# EAGLE design G221B (EAGLE 6.6.0)
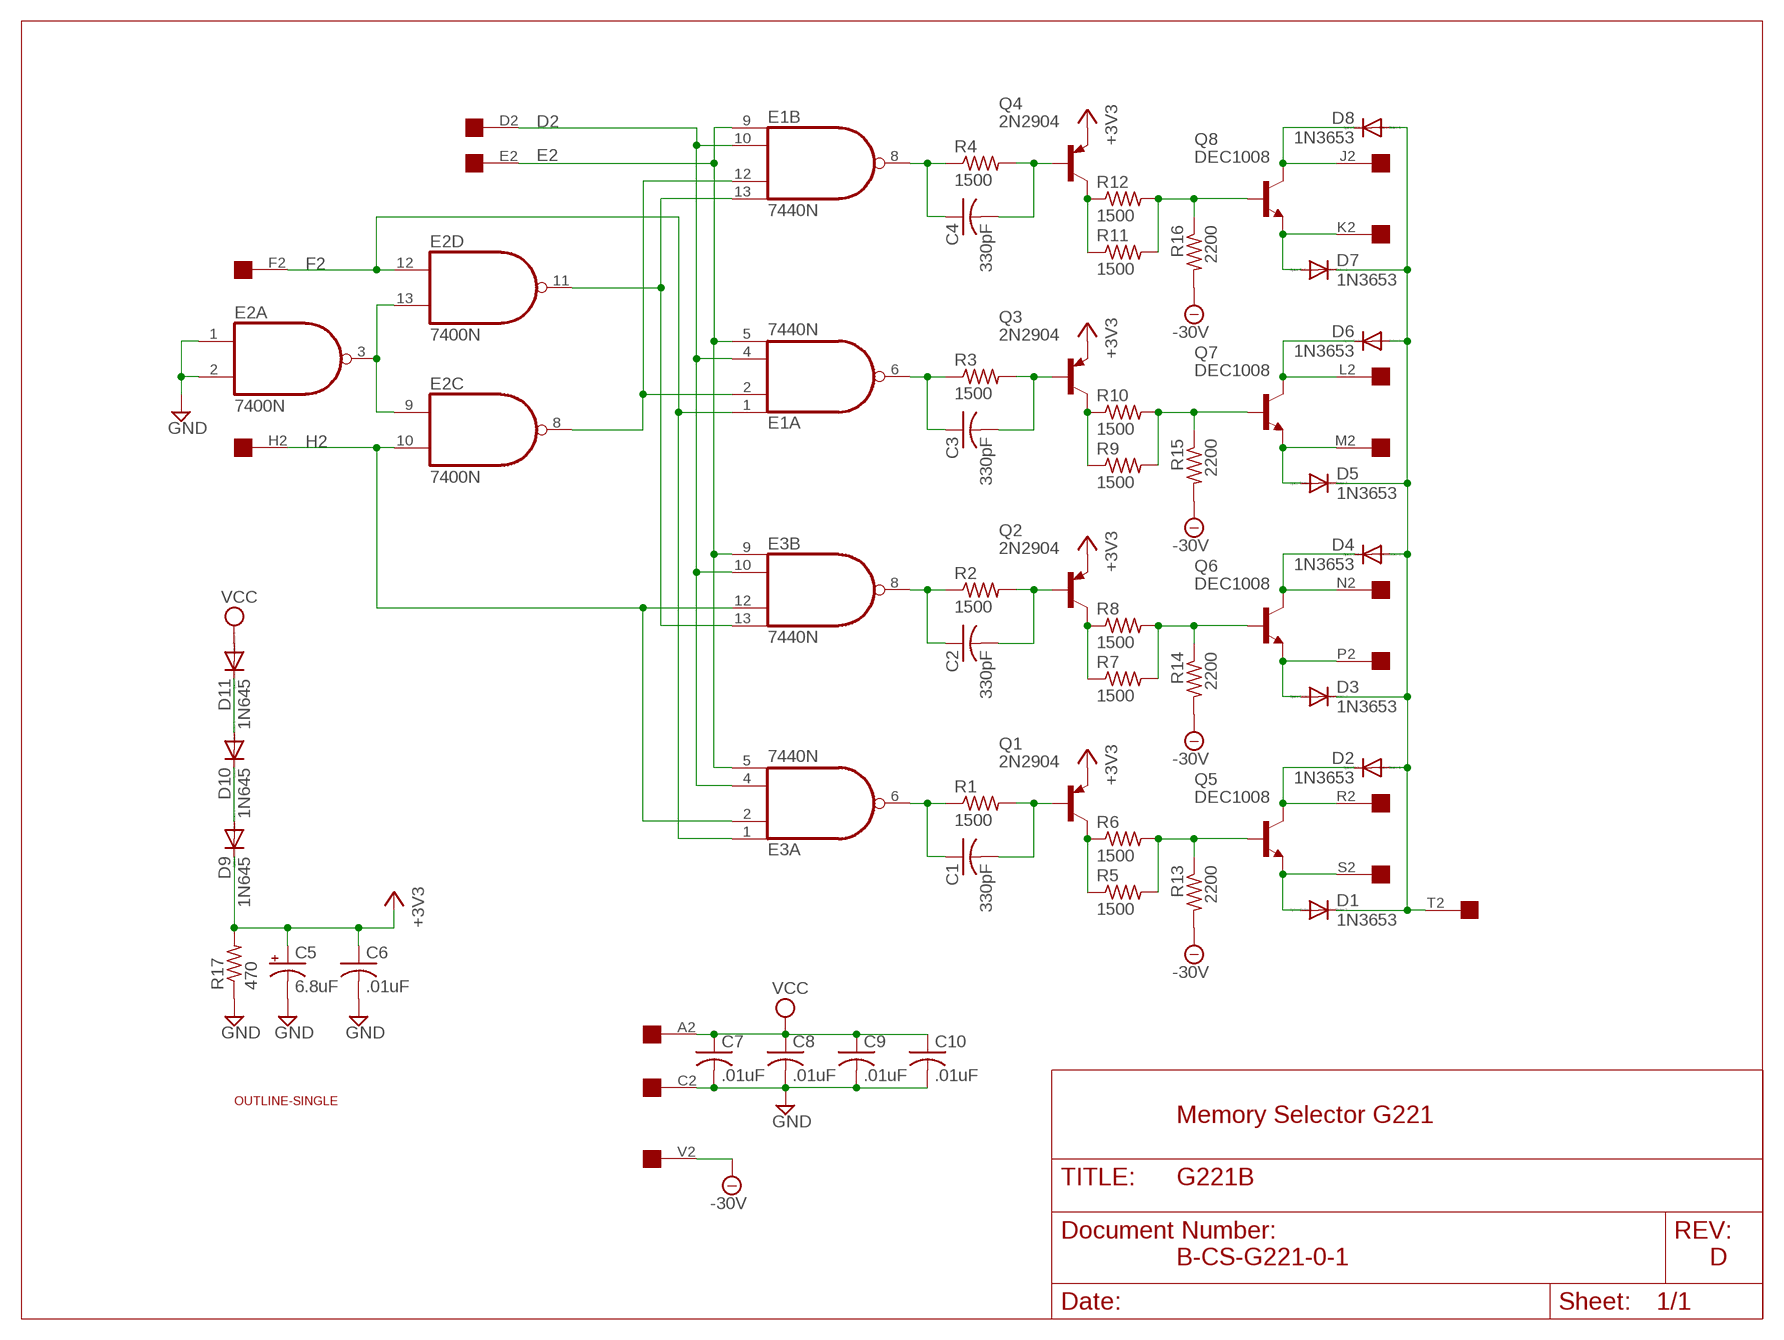
[diagram p0: schematic, sheet 1]

## Parts
C1  330pF  C-US050-025X075  [C050-025X075]
C2  330pF  C-US050-025X075  [C050-025X075]
C3  330pF  C-US050-025X075  [C050-025X075]
C4  330pF  C-US050-025X075  [C050-025X075]
C5  6.8uF  CPOL-USE20-8AXIAL  [E12-8]
C6  .01uF  C-US050-025X075  [C050-025X075]
C7  .01uF  C-US050-025X075  [C050-025X075]
C8  .01uF  C-US050-025X075  [C050-025X075]
C9  .01uF  C-US050-025X075  [C050-025X075]
C10  .01uF  C-US050-025X075  [C050-025X075]
D1  1N3653  1N4148DO35-10  [DO35-10]
D2  1N3653  1N4148DO35-10  [DO35-10]
D3  1N3653  1N4148DO35-10  [DO35-10]
D4  1N3653  1N4148DO35-10  [DO35-10]
D5  1N3653  1N4148DO35-10  [DO35-10]
D6  1N3653  1N4148DO35-10  [DO35-10]
D7  1N3653  1N4148DO35-10  [DO35-10]
D8  1N3653  1N4148DO35-10  [DO35-10]
D9  1N645  1N4148DO35-10  [DO35-10]
D10  1N645  1N4148DO35-10  [DO35-10]
D11  1N645  1N4148DO35-10  [DO35-10]
E1  7440N  74S20N  [DIL14]
E2  7400N  [DIL14]
E3  7440N  74S20N  [DIL14]
Q1  2N2904  [TO39]
Q2  2N2904  [TO39]
Q3  2N2904  [TO39]
Q4  2N2904  [TO39]
Q5  DEC1008  2N1613-NPN-TO39-EBC  [TO39]
Q6  DEC1008  2N1613-NPN-TO39-EBC  [TO39]
Q7  DEC1008  2N1613-NPN-TO39-EBC  [TO39]
Q8  DEC1008  2N1613-NPN-TO39-EBC  [TO39]
R1  1500  R-US_0207/10  [0207/10]
R2  1500  R-US_0207/10  [0207/10]
R3  1500  R-US_0207/10  [0207/10]
R4  1500  R-US_0207/10  [0207/10]
R5  1500  R-US_0207/10  [0207/10]
R6  1500  R-US_0207/10  [0207/10]
R7  1500  R-US_0207/10  [0207/10]
R8  1500  R-US_0207/10  [0207/10]
R9  1500  R-US_0207/10  [0207/10]
R10  1500  R-US_0207/10  [0207/10]
R11  1500  R-US_0207/10  [0207/10]
R12  1500  R-US_0207/10  [0207/10]
R13  2200  R-US_0207/10  [0207/10]
R14  2200  R-US_0207/10  [0207/10]
R15  2200  R-US_0207/10  [0207/10]
R16  2200  R-US_0207/10  [0207/10]
R17  470  R-US_0207/10  [0207/10]
U$1  EDGE-1  [EDGE-CON1]
U$7  OUTLINE-SINGLE  [SINGLE]

## Nets
+3V3: C5.+ C6.1 D9.C Q1.1(E) Q2.1(E) Q3.1(E) Q4.1(E) R17.2
-24V [supply]: R13.2 R14.2 R15.2 R16.2 U$1.V2 ; supply symbol labelled -30V
D2: E1.4(A:I2) E1.10(B:I1) E3.4(A:I2) E3.10(B:I1) U$1.D2
E2: E1.5(A:I3) E1.9(B:I0) E3.5(A:I3) E3.9(B:I0) U$1.E2
F2: E1.1(A:I0) E2.12(D:I0) E3.1(A:I0) U$1.F2
GND [supply]: C5.- C6.2 C7.2 C8.2 C9.2 C10.2 E2.1(A:I0) E2.2(A:I1) R17.1 U$1.C2
H2: E2.10(C:I1) E3.2(A:I1) E3.12(B:I2) U$1.H2
J2: D8.C Q8.3(C) U$1.J2
K2: D7.A Q8.1(E) U$1.K2
L2: D6.C Q7.3(C) U$1.L2
M2: D5.A Q7.1(E) U$1.M2
N2: D4.C Q6.3(C) U$1.N2
N$1: C1.1 E3.6(A:O) R1.1
N$2: Q1.3(C) R5.1 R6.1
N$3: Q5.2(B) R5.2 R6.2 R13.1
N$4: Q2.3(C) R7.1 R8.1
N$5: Q6.2(B) R7.2 R8.2 R14.1
N$6: E2.3(A:O) E2.9(C:I0) E2.13(D:I1)
N$7: C1.2 Q1.2(B) R1.2
N$8: C2.1 E3.8(B:O) R2.1
N$9: C2.2 Q2.2(B) R2.2
N$10: E1.13(B:I3) E2.11(D:O) E3.13(B:I3)
N$11: C3.1 E1.6(A:O) R3.1
N$12: E1.2(A:I1) E1.12(B:I2) E2.8(C:O)
N$13: C3.2 Q3.2(B) R3.2
N$14: D9.A D10.C
N$15: C4.1 E1.8(B:O) R4.1
N$16: D10.A D11.C
N$17: C4.2 Q4.2(B) R4.2
N$18: Q3.3(C) R9.1 R10.1
N$19: Q7.2(B) R9.2 R10.2 R15.1
N$20: Q4.3(C) R11.1 R12.1
N$21: Q8.2(B) R11.2 R12.2 R16.1
P2: D3.A Q6.1(E) U$1.P2
R2: D2.C Q5.3(C) U$1.R2
S2: D1.A Q5.1(E) U$1.S2
T2: D1.C D2.A D3.C D4.A D5.C D6.A D7.C D8.A U$1.T2
VCC [supply]: C7.1 C8.1 C9.1 C10.1 D11.A U$1.A2
Unconnected: E2.4(B:I0) E2.5(B:I1) E2.6(B:O) U$1.B2 U$1.U2

## Notes on the sheet
- Memory Selector G221
- B-CS-G221-0-1 | D

## Power pins joined to a net without a drawn wire
GND: E1.7(P:GND) E2.7(P:GND) E3.7(P:GND)
VCC: E1.14(P:VCC) E2.14(P:VCC) E3.14(P:VCC)

## Library data of the parts
C1-C4 C6-C10 = rcl:C-US: CAPACITOR, American symbol
C5 = dec-con:CPOL-USE20-8AXIAL: A 0.8 inch electrolytic.
D1-D11 = diode:1N4148: DIODE high speed (Philips)
E1 E3 = 74xx-us:74*20: Dual 4-input NAND gate
E2 = 74xx-us:74*00: Quad 2-input NAND gate
Q1-Q4 = transistor-pnp:2N2904*: PNP Transistror
Q5-Q8 = transistor:*-NPN-: NPN Transistror BF959 corrected 2008.03.06
R1-R17 = rcl:R-US_: RESISTOR, American symbol
U$1 = dec-con:EDGE-1: Single-Sided DEC Edge Connector -- (side 2)
U$7 = dec-con:OUTLINE-*: Board outlines for DEC boards.

## Net classes
1 supply: width 0.813 mm

## Board
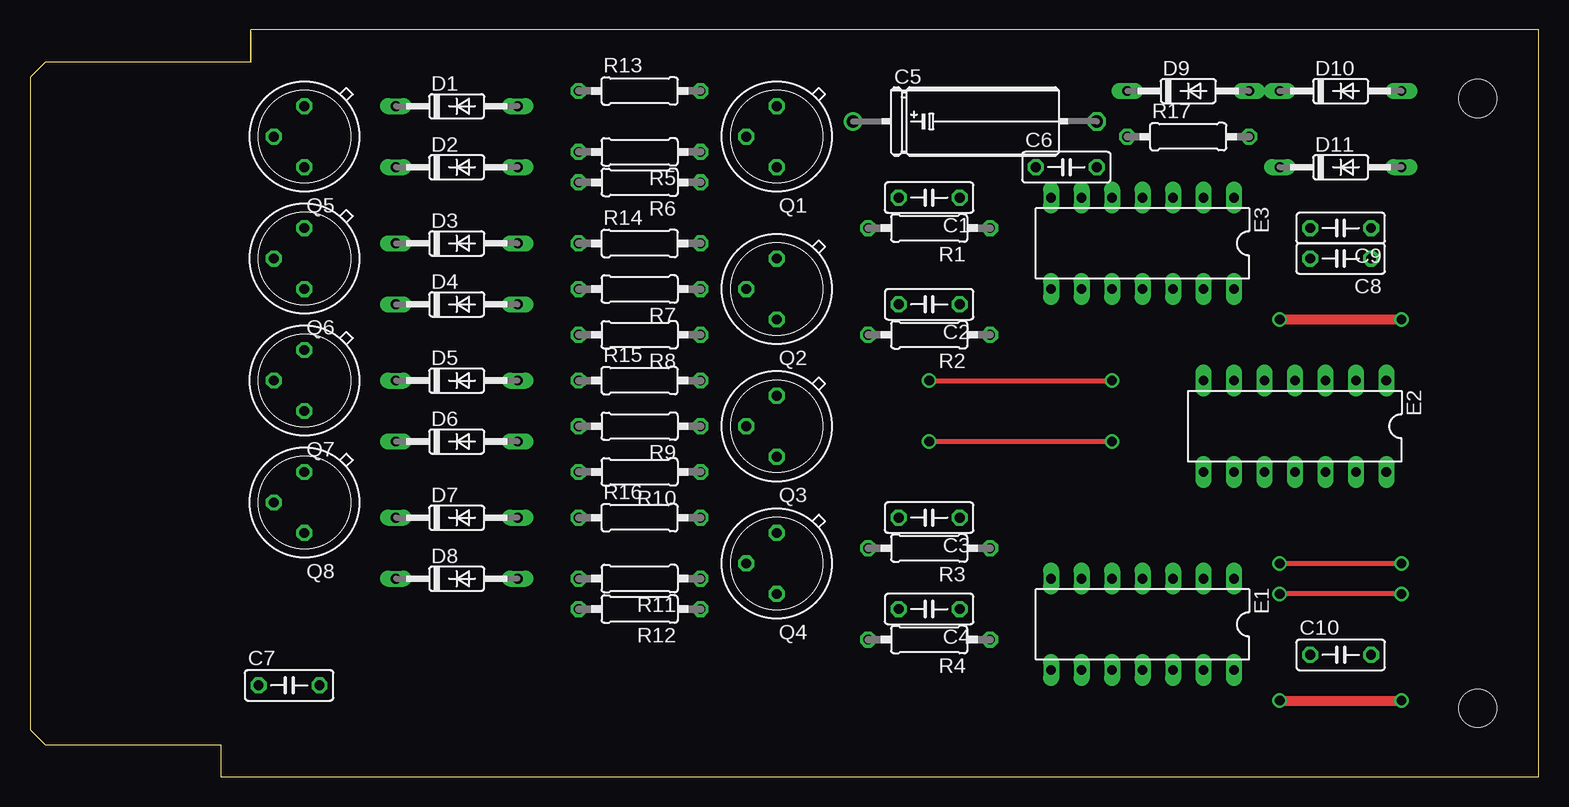
[diagram p1: board, top side]
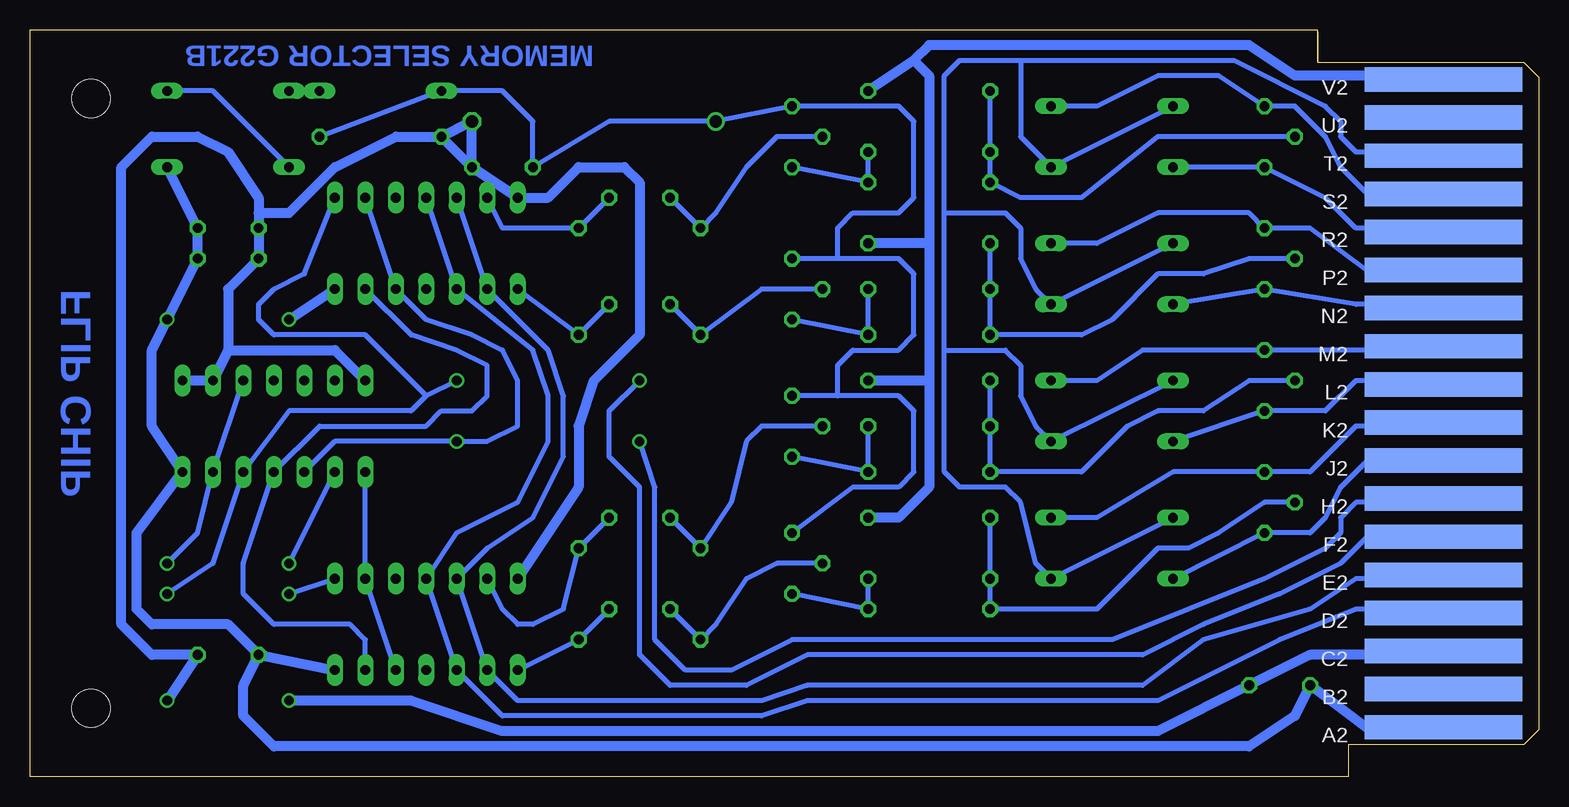
[diagram p2: board, bottom side, seen from below]

Size 125.73 x 62.23 mm. Coordinates in mm from the lower left corner, seen from the top.
Copper layers (1+16): Top 0.035mm / dielectric 1.5mm / Bottom 0.035mm
Design rules "16mils": minimum track width 16mil, minimum drill 32mil, track to track 15mil, track to pad 10mil, pad to pad 10mil, via to via 10mil, smd to smd 10mil, copper to edge 13mil, drill to drill 10mil, minimum pad ring 10mil, minimum via ring 8mil, stop-mask expansion 0mil, vias tented up to drill 0mil, thermal gap 10mil

### Footprints (pad centres in the part's own frame; a part is rotated, then mirrored left to right if it is on the bottom)
C050-025X075 = drill 0.813 octagon: 1 -2.54,0; 2 2.54,0
E12-8 = drill 1.016: + -10.16,0 | drill 1.016 octagon: - 10.16,0
DO35-10 = drill 0.813 long: A 5.08,0; C -5.08,0
DIL14 = drill 0.813 long: 1 -7.62,-3.81; 2 -5.08,-3.81; 3 -2.54,-3.81; 4 0,-3.81; 5 2.54,-3.81; 6 5.08,-3.81; 7 7.62,-3.81; 8 7.62,3.81; 9 5.08,3.81; 10 2.54,3.81; 11 0,3.81; 12 -2.54,3.81; 13 -5.08,3.81; 14 -7.62,3.81
TO39 = drill 0.813 octagon: 1 0,-2.54; 2 2.54,0; 3 0,2.54
0207/10 = drill 0.813 octagon: 1 -5.08,0; 2 5.08,0
EDGE-CON1 = smd 13.106 x 2.032 bottom: A2 7.938,4.128; B2 7.938,7.303; C2 7.938,10.477; D2 7.938,13.652; E2 7.938,16.828; F2 7.938,20.003; H2 7.938,23.177; J2 7.938,26.352; K2 7.938,29.527; L2 7.938,32.703; M2 7.938,35.877; N2 7.938,39.053; P2 7.938,42.227; R2 7.938,45.403; S2 7.938,48.578; T2 7.938,51.752; U2 7.938,54.928; V2 7.938,58.102
SINGLE = hole 3.175: 120.65,56.515; 120.65,5.715

### Placement (x,y rotation side)
C1  74.93,48.26 180 top
C2  74.93,39.37 180 top
C3  74.93,21.59 180 top
C4  74.93,13.97 180 top
C5  78.74,54.61 0 top
C6  86.36,50.8 0 top
C7  21.59,7.62 0 top
C8  109.22,43.18 180 top
C9  109.22,45.72 180 top
C10  109.22,10.16 0 top
D1  35.56,55.88 0 top
D2  35.56,50.8 0 top
D3  35.56,44.45 0 top
D4  35.56,39.37 0 top
D5  35.56,33.02 0 top
D6  35.56,27.94 0 top
D7  35.56,21.59 0 top
D8  35.56,16.51 0 top
D9  96.52,57.15 0 top
D10  109.22,57.15 0 top
D11  109.22,50.8 0 top
E1  92.71,12.7 180 top
E2  105.41,29.21 180 top
E3  92.71,44.45 180 top
Q1  62.23,53.34 180 top
Q2  62.23,40.64 180 top
Q3  62.23,29.21 180 top
Q4  62.23,17.78 180 top
Q5  22.86,53.34 180 top
Q6  22.86,43.18 180 top
Q7  22.86,33.02 180 top
Q8  22.86,22.86 180 top
R1  74.93,45.72 180 top
R2  74.93,36.83 180 top
R3  74.93,19.05 180 top
R4  74.93,11.43 180 top
R5  50.8,52.07 180 top
R6  50.8,49.53 180 top
R7  50.8,40.64 180 top
R8  50.8,36.83 180 top
R9  50.8,29.21 180 top
R10  50.8,25.4 180 top
R11  50.8,16.51 180 top
R12  50.8,13.97 180 top
R13  50.8,57.15 0 top
R14  50.8,44.45 0 top
R15  50.8,33.02 0 top
R16  50.8,21.59 0 top
R17  96.52,53.34 0 top
U$1  0,0 0 top
U$7  0,0 0 top

### Tracks (layer width: path | path; a pad name or v marks a point on that pad's centre or on a via)
+3V3
  Bottom 0.406: R17.2 D9.C 86.36,57.15 83.82,54.61 C6.1 77.47,54.61 C5.+ Q1.1 53.34,55.88 52.07,54.61 52.07,48.26 53.34,46.99 57.15,46.99 58.42,45.72 58.42,43.18 | Q4.1 57.15,24.13 53.34,24.13 52.07,25.4 52.07,30.48 53.34,31.75 58.42,31.75 | 58.42,31.75 Q3.1 | 58.42,43.18 53.34,43.18 52.07,41.91 52.07,36.83 53.34,35.56 57.15,35.56 58.42,34.29 58.42,31.75 | 58.42,43.18 Q2.1
-24V
  Bottom 0.813: U$1.V2 10.16,58.42 20.32,58.42 24.13,60.96 50.8,60.96 52.07,59.69 | 52.07,59.69 R13.2 | R16.2 53.34,21.59 50.8,24.13 50.8,33.02 | 50.8,33.02 R15.2 | 50.8,44.45 R14.2 | 50.8,44.45 50.8,33.02 | 52.07,59.69 50.8,58.42 50.8,44.45
D2
  Bottom 0.406: E3.4 E3.10 83.82,35.56 82.55,31.75 82.55,27.94 85.09,22.86 90.17,20.32 E1.4 E1.10 86.36,5.08 64.77,5.08 60.96,6.35 31.75,6.35 21.59,11.43 15.24,13.97 8.89,13.97 U$1.D2
E2
  Bottom 0.406: E3.5 E3.9 82.55,35.56 81.28,31.75 81.28,26.67 83.82,21.59 87.63,19.05 E1.5 E1.9 85.09,6.35 64.77,6.35 60.96,7.62 33.02,7.62 27.94,11.43 19.05,13.97 15.24,16.51 8.89,16.51 U$1.E2
F2  (via drill 0.81)
  Top 0.406: v114.3,15.24 v104.14,15.24 | v74.93,33.02 v90.17,33.02
  Bottom 0.406: v104.14,15.24 E1.1 | v114.3,15.24 110.49,17.78 E2.12 104.14,30.48 93.98,30.48 92.71,31.75 | v90.17,33.02 92.71,31.75 | E3.1 102.87,41.91 105.41,40.64 106.68,39.37 106.68,38.1 105.41,36.83 97.79,36.83 92.71,31.75 | U$1.F2 8.89,20.32 13.97,20.32 16.51,17.78 21.59,15.24 27.94,12.7 33.02,10.16 60.96,10.16 66.04,7.62 72.39,7.62 74.93,10.16 74.93,24.13 77.47,26.67 77.47,30.48 v74.93,33.02
GND  (via drill 0.81)
  Top 0.813: v104.14,6.35 v114.3,6.35
  Bottom 0.813: U$1.C2 8.89,10.16 19.05,10.16 C7.2 31.75,3.81 86.36,3.81 93.98,6.35 v104.14,6.35 | 109.22,35.56 109.22,40.64 C8.2 C9.2 106.68,46.99 | 109.22,35.56 E2.2 E2.1 | E2.7 100.33,35.56 109.22,35.56 | E1.7 80.01,24.13 80.01,29.21 78.74,33.02 74.93,36.83 74.93,49.53 76.2,50.8 80.01,50.8 82.55,48.26 E3.7 C6.2 | v114.3,6.35 C10.2 115.57,10.16 118.11,12.7 118.11,50.8 115.57,53.34 111.76,53.34 109.22,52.07 106.68,48.26 106.68,46.99 | R17.1 C6.2 | R17.1 C5.- C6.2 | R17.1 95.25,53.34 100.33,50.8 104.14,46.99 106.68,46.99
H2  (via drill 0.81)
  Top 0.406: v74.93,27.94 v90.17,27.94
  Bottom 0.406: E3.2 E3.12 92.71,38.1 88.9,36.83 86.36,35.56 85.09,33.02 85.09,29.21 87.63,27.94 v90.17,27.94 100.33,27.94 E2.10 | U$1.H2 8.89,22.86 15.24,22.86 16.51,21.59 16.51,20.32 17.78,19.05 22.86,16.51 35.56,11.43 62.23,11.43 67.31,8.89 71.12,8.89 73.66,11.43 73.66,24.13 v74.93,27.94
J2
  Bottom 0.406: U$1.J2 8.89,26.67 13.97,26.67 16.51,24.13 17.78,21.59 19.05,20.32 Q8.3 D8.C
K2
  Bottom 0.406: U$1.K2 8.89,29.21 15.24,29.21 19.05,25.4 Q8.1 30.48,25.4 36.83,21.59 D7.A
L2
  Bottom 0.406: U$1.L2 8.89,33.02 15.24,33.02 17.78,30.48 Q7.3 D6.C
M2
  Bottom 0.406: D5.A 36.83,33.02 33.02,35.56 Q7.1 8.89,35.56 U$1.M2
N2
  Bottom 0.406: U$1.N2 8.89,39.37 15.24,39.37 Q6.3 D4.C
N$1
  Bottom 0.406: C1.1 R1.1 86.36,45.72 E3.6
N$2
  Bottom 0.406: R5.1 R6.1 Q1.3
N$3
  Bottom 0.406: Q5.2 31.75,53.34 38.1,48.26 43.18,48.26 R6.2 R5.2 R13.1
N$4
  Bottom 0.406: R7.1 R8.1 Q2.3
N$5
  Bottom 0.406: Q6.2 24.13,43.18 27.94,41.91 31.75,41.91 35.56,38.1 38.1,36.83 R8.2 R7.2 R14.1
N$6  (via drill 0.81)
  Top 0.406: v104.14,17.78 v114.3,17.78
  Bottom 0.406: v104.14,17.78 E2.9 | E2.3 E2.13 111.76,20.32 v114.3,17.78
N$7
  Bottom 0.406: Q1.2 63.5,53.34 66.04,50.8 68.58,46.99 R1.2 C1.2
N$8
  Bottom 0.406: C2.1 R2.1 E3.8
N$9
  Bottom 0.406: Q2.2 64.77,40.64 R2.2 C2.2
N$10
  Bottom 0.406: E1.13 97.79,11.43 99.06,12.7 105.41,12.7 107.95,15.24 107.95,17.78 E2.11 101.6,29.21 92.71,29.21 91.44,30.48 88.9,30.48 87.63,31.75 87.63,34.29 90.17,35.56 93.98,36.83 E3.13
N$11
  Bottom 0.406: E1.6 86.36,13.97 85.09,12.7 83.82,12.7 81.28,13.97 R3.1 C3.1
N$12
  Bottom 0.406: E1.12 E1.2 E2.8
N$13
  Bottom 0.406: Q3.2 64.77,29.21 66.04,27.94 67.31,22.86 R3.2 C3.2
N$14
  Bottom 0.406: D9.A D10.C
N$15
  Bottom 0.406: C4.1 R4.1 E1.8
N$16
  Bottom 0.406: D11.C 110.49,57.15 D10.A
N$17
  Bottom 0.406: C4.2 R4.2 68.58,12.7 66.04,16.51 63.5,17.78 Q4.2
N$18
  Bottom 0.406: R9.1 R10.1 Q3.3
N$19
  Bottom 0.406: R15.1 R9.2 R10.2 38.1,25.4 34.29,29.21 31.75,30.48 27.94,30.48 24.13,33.02 Q7.2
N$20
  Bottom 0.406: R11.1 R12.1 Q4.3
N$21
  Bottom 0.406: Q8.2 22.86,22.86 26.67,20.32 29.21,19.05 31.75,19.05 36.83,13.97 R12.2 R11.2 R16.1
P2
  Bottom 0.406: U$1.P2 8.89,41.91 13.97,41.91 19.05,45.72 Q6.1 24.13,46.99 31.75,46.99 36.83,44.45 D3.A
R2
  Bottom 0.406: D2.C Q5.3 17.78,48.26 15.24,45.72 8.89,45.72 U$1.R2
S2
  Bottom 0.406: D1.A 36.83,55.88 31.75,58.42 26.67,58.42 Q5.1 20.32,55.88 17.78,53.34 16.51,50.8 13.97,48.26 8.89,48.26 U$1.S2
T2
  Bottom 0.406: D1.C D2.A 43.18,53.34 43.18,59.69 | D3.C D4.A 41.91,40.64 43.18,43.18 43.18,45.72 44.45,46.99 49.53,46.99 | D5.C D6.A 41.91,29.21 43.18,31.75 43.18,34.29 44.45,35.56 49.53,35.56 | D7.C D8.A 41.91,17.78 43.18,22.86 44.45,24.13 48.26,24.13 49.53,25.4 49.53,35.56 | U$1.T2 8.89,52.07 15.24,52.07 16.51,53.34 16.51,54.61 17.78,55.88 25.4,59.69 43.18,59.69 | 43.18,59.69 48.26,59.69 49.53,58.42 49.53,46.99 | 49.53,35.56 49.53,46.99
VCC  (via drill 0.81)
  Top 0.813: v114.3,38.1 v104.14,38.1
  Bottom 0.813: U$1.A2 8.89,3.81 13.97,3.81 C7.1 20.32,5.08 24.13,2.54 105.41,2.54 107.95,5.08 107.95,7.62 C10.1 | C10.1 E1.14 | v104.14,38.1 E3.14 | D11.A C9.1 C8.1 v114.3,38.1 115.57,35.56 115.57,29.21 E2.14 116.84,20.32 116.84,13.97 115.57,12.7 109.22,12.7 C10.1

### Text on the board
Bottom: MEMORY SELECTOR G221B | FLIP CHIP